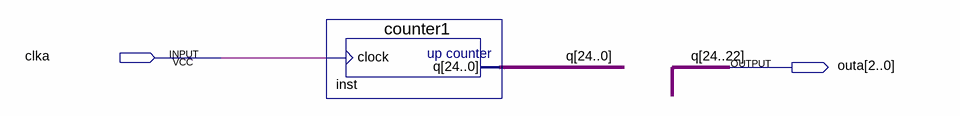
[diagram p0: schematic sheet]
// Quartus schematic test.bdf as structural Verilog: 1 symbols, 2 pins
module test (
  input  clka,
  output [2:0] outa
);

  wire [21:0] q;

  counter1 inst (.clock(clka), .q({outa, q}));

  // Other names for the same wires on the sheet: q[24:22] = outa
endmodule
